# EAGLE design lcd240 (EAGLE 9.6.2)
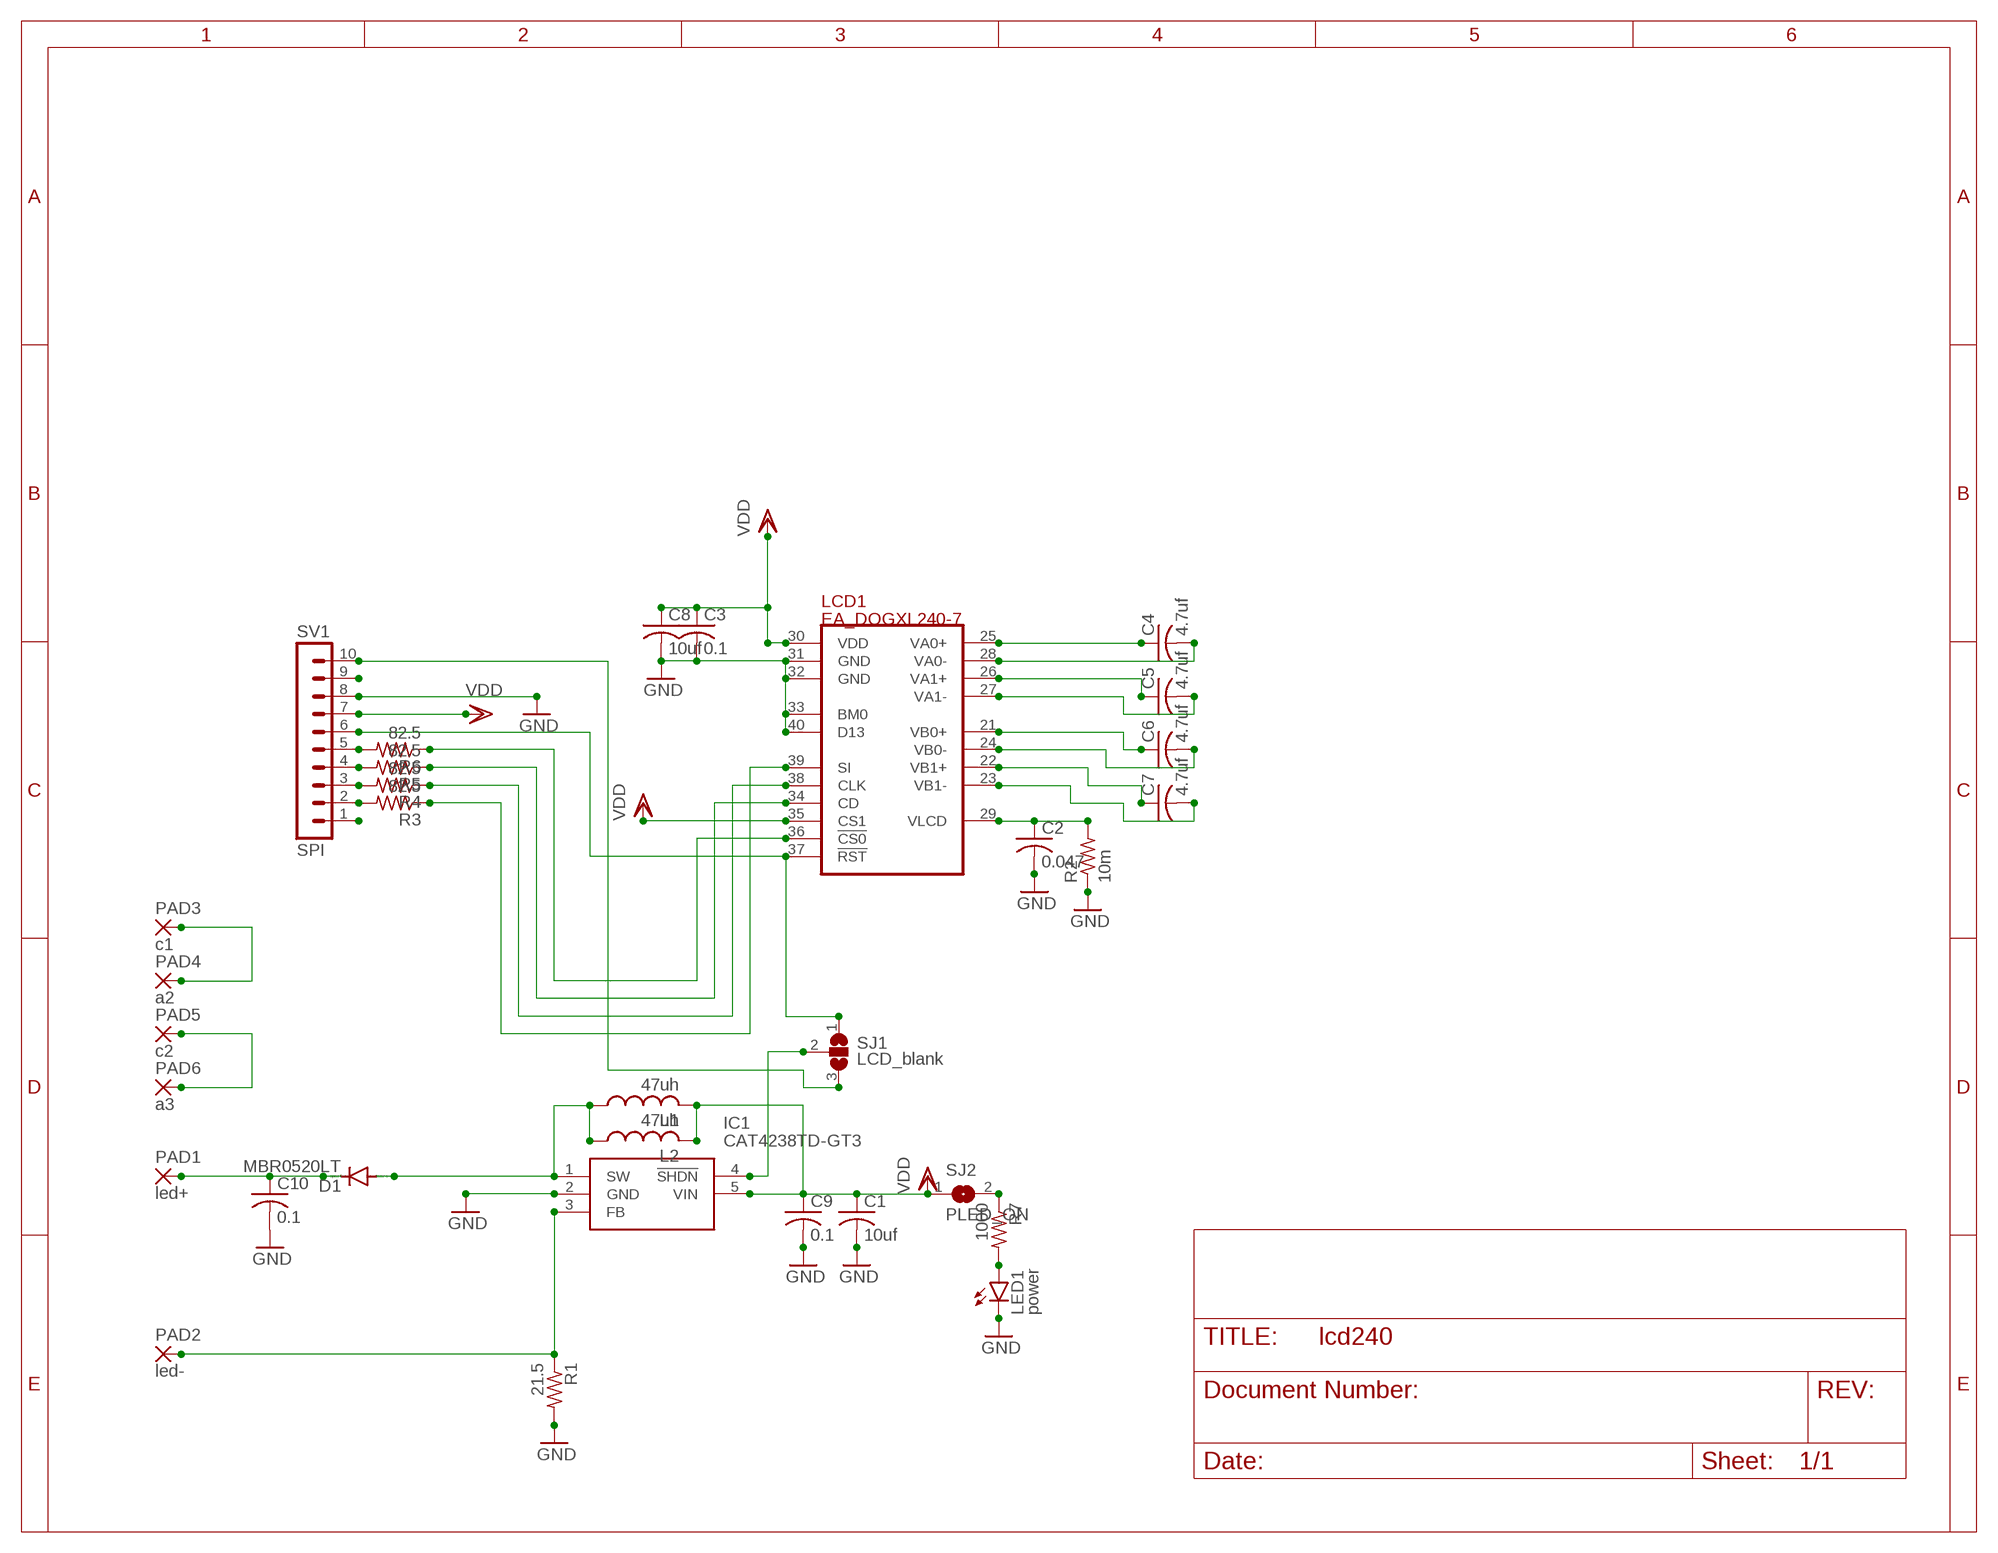
[diagram p0: schematic, sheet 1]

## Parts
C1  10uf  C-USC1206  [C1206]
C2  0.047  C-USC1206  [C1206]
C3  0.1  C-USC1206  [C1206]
C4  4.7uf  C-USC1206  [C1206]
C5  4.7uf  C-USC1206  [C1206]
C6  4.7uf  C-USC1206  [C1206]
C7  4.7uf  C-USC1206  [C1206]
C8  10uf  C-USC1206  [C1206]
C9  0.1  C-USC1206  [C1206]
C10  0.1  C-USC1206  [C1206]
D1  MBR0520LT  [SOD123]
IC1  CAT4238TD-GT3  [SOT95P280X100-5N]
L1  47uh  L-US0204/5  [0204/5]
L2  47uh  L-USL2012C  [L2012C]
LCD1  EA_DOGXL240-7  [EA_DOGXL240-7]
LED1  power  LEDSML0805  [SML0805]
PAD1  led+  1,6/0,8  [1,6/0,8]
PAD2  led-  1,6/0,8  [1,6/0,8]
PAD3  c1  1,6/0,8  [1,6/0,8]
PAD4  a2  1,6/0,8  [1,6/0,8]
PAD5  c2  1,6/0,8  [1,6/0,8]
PAD6  a3  1,6/0,8  [1,6/0,8]
R1  21.5  R-US_R0805  [R0805]
R2  10m  R-US_R0805  [R0805]
R3  82.5  R-US_R0805  [R0805]
R4  82.5  R-US_R0805  [R0805]
R5  82.5  R-US_R0805  [R0805]
R6  82.5  R-US_R0805  [R0805]
R7  1000  R-US_R0805  [R0805]
SJ1  LCD_blank  SJ2W  [SJ_2]
SJ2  PLED_ON  SJ  [SJ]
SV1  SPI  MA10-1  [MA10-1]

## Nets
GND [icurrent]: C1.2 C2.2 C3.2 C8.2 C9.2 C10.2 IC1.2(GND) LCD1.31(GND) LCD1.32(GND) LCD1.33(BM0) LCD1.40(D13) LED1.C R1.2 R2.1 SV1.8
N$1: C4.2 LCD1.28(VA0-)
N$2: C5.1 LCD1.26(VA1+)
N$3: C2.1 LCD1.29(VLCD) R2.2
N$4: LCD1.37(!RST!) SJ1.1 SV1.6
N$5: C5.2 LCD1.27(VA1-)
N$6: C4.1 LCD1.25(VA0+)
N$7: C6.1 LCD1.21(VB0+)
N$8: C6.2 LCD1.24(VB0-)
N$9: C7.1 LCD1.22(VB1+)
N$10: C7.2 LCD1.23(VB1-)
N$11: LCD1.36(!CS0!) R6.1
N$12: LCD1.34(CD) R5.1
N$13: LCD1.38(CLK) R4.1
N$14: LCD1.39(SI) R3.1
N$15 [led]: C10.1 D1.C PAD1.1(P)
N$16: SV1.9
N$17: SJ1.3 SV1.10
N$18: SV1.1
N$19: R3.2 SV1.2
N$20: R4.2 SV1.3
N$21: R6.2 SV1.5
N$22: R5.2 SV1.4
N$23: D1.A IC1.1(SW) L1.1 L2.1
N$24 [led]: IC1.3(FB) PAD2.1(P) R1.1
N$25 [led]: PAD3.1(P) PAD4.1(P)
N$26 [led]: PAD5.1(P) PAD6.1(P)
N$27: IC1.4(!SHDN) SJ1.2
N$28: R7.1 SJ2.2
N$29: LED1.A R7.2
VDD [icurrent]: C1.1 C3.1 C8.1 C9.1 IC1.5(VIN) L1.2 L2.2 LCD1.30(VDD) LCD1.35(CS1) SJ2.1 SV1.7

## Library data of the parts
C1-C10 = rcl:C-US: CAPACITOR, American symbol; SPICEPREFIX: C
D1 = diode:MBR0520LT: SCHOTTKY BARRIER RECTIFIER Source: http://onsemi.com .. MBR0520LT1-D.pdf
IC1 = CAT4238TD-GT3:CAT4238TD-GT3: Source: Datasheet <http://www.onsemi.com/pub/Collateral/CAT4238-D.PDF>; ARROW_PART_NUMBER: CAT4238TD-GT3; ARROW_PRICE-STOCK: https://www.arrow.com/en/products/cat4238td-gt3/on-semiconductor; HEIGHT: 1mm; MANUFACTURER_NAME: ON Semiconductor; MANUFACTURER_PART_NUMBER: CAT4238TD-GT3; MOUSER_PART_NUMBER: 698-CAT4238TDG; MOUSER_PRICE-STOCK: https://www.mouser.co.uk/ProductDetail/ON-Semiconductor/CAT4238TD-GT3?qs=9dFQwQorgSxpbLptXYtgxg%3D%3D
L1 L2 = rcl:L-US: INDUCTOR, American symbol; SPICEPREFIX: L
LCD1 = ea_v66:EA_DOGXL240-7
LED1 = led:LED: LED OSRAM: - CHIPLED LG R971, LG N971, LY N971, LG Q971, LY Q971, LO R971, LY R971 LH N974, LH R974 LS Q976, LO Q976, LY Q976 LO Q996 - Hyper CHIPLED LW Q18S LB Q993, LB Q99A, LB R99A - SideLED LS A670, LO A670, LY A670, LG A670, LP A670 LB A673, LV A673, LT A673, LW A673 LH A674 LY A675 LS A676, LA A676, LO A676, LY A676, LW A676 LS A679, LY A679, LG A679 - Hyper Micro SIDELED® LS Y876, LA Y876, LO Y876, LY Y876 LT Y87S - SmartLED LW L88C, LW L88S LB L89C, LB L89S, LG L890 LS L89K, LO L89K, LY L89K LS L896, LA L896, LO L896, LY L896 - TOPLED LS T670, LO T670, LY T670, LG T670, LP T670 LSG T670, LSP T670, LSY T670, LOP T670, LYG T670 LG T671, LOG T671, LSG T671 LB T673, LV T673, LT T673, LW T673 LH T674 LS T676, LA T676, LO T676, LY T676, LB T676, LH T676, LSB T676, LW T676 LB T67C, LV T67C, LT T67C, LS T67K, LO T67K, LY T67K, LW E67C LS E67B, LA E67B, LO E67B, LY E67B, LB E67C, LV E67C, LT E67C LW T67C LS T679, LY T679, LG T679 LS T770, LO T770, LY T770, LG T770, LP T770 LB T773, LV T773, LT T773, LW T773 LH T774 LS E675, LA E675, LY E675, LS T675 LS T776, LA T776, LO T776, LY T776, LB T776 LHGB T686 LT T68C, LB T68C - Hyper Mini TOPLED® LB M676 - Mini TOPLED Santana® LG M470 LS M47K, LO M47K, LY M47K Source: http://www.osram.convergy.de LUXEON: - LUMILED® LXK2-PW12-R00, LXK2-PW12-S00, LXK2-PW14-U00, LXK2-PW14-V00 LXK2-PM12-R00, LXK2-PM12-S00, LXK2-PM14-U00 LXK2-PE12-Q00, LXK2-PE12-R00, LXK2-PE12-S00, LXK2-PE14-T00, LXK2-PE14-U00 LXK2-PB12-K00, LXK2-PB12-L00, LXK2-PB12-M00, LXK2-PB14-N00, LXK2-PB14-P00, LXK2-PB14-Q00 LXK2-PR12-L00, LXK2-PR12-M00, LXK2-PR14-Q00, LXK2-PR14-R00 LXK2-PD12-Q00, LXK2-PD12-R00, LXK2-PD12-S00 LXK2-PH12-R00, LXK2-PH12-S00 LXK2-PL12-P00, LXK2-PL12-Q00, LXK2-PL12-R00 Source: www.luxeon.com KINGBRIGHT: KA-3528ASYC Source: www.kingbright.com
PAD1-PAD6 = wirepad:1,6/0,8: THROUGH-HOLE PAD
R1-R7 = rcl:R-US_: RESISTOR, American symbol; SPICEPREFIX: R
SJ1 = jumper:SJ2W: SMD solder JUMPER
SJ2 = jumper:SJ: SMD solder JUMPER
SV1 = con-lstb:MA10-1: PIN HEADER; OC_FARNELL: unknown; OC_NEWARK: unknown

## Net classes
1 icurrent: width 0.305 mm
2 led: width 0.305 mm, clearance 0.406 mm

## Board
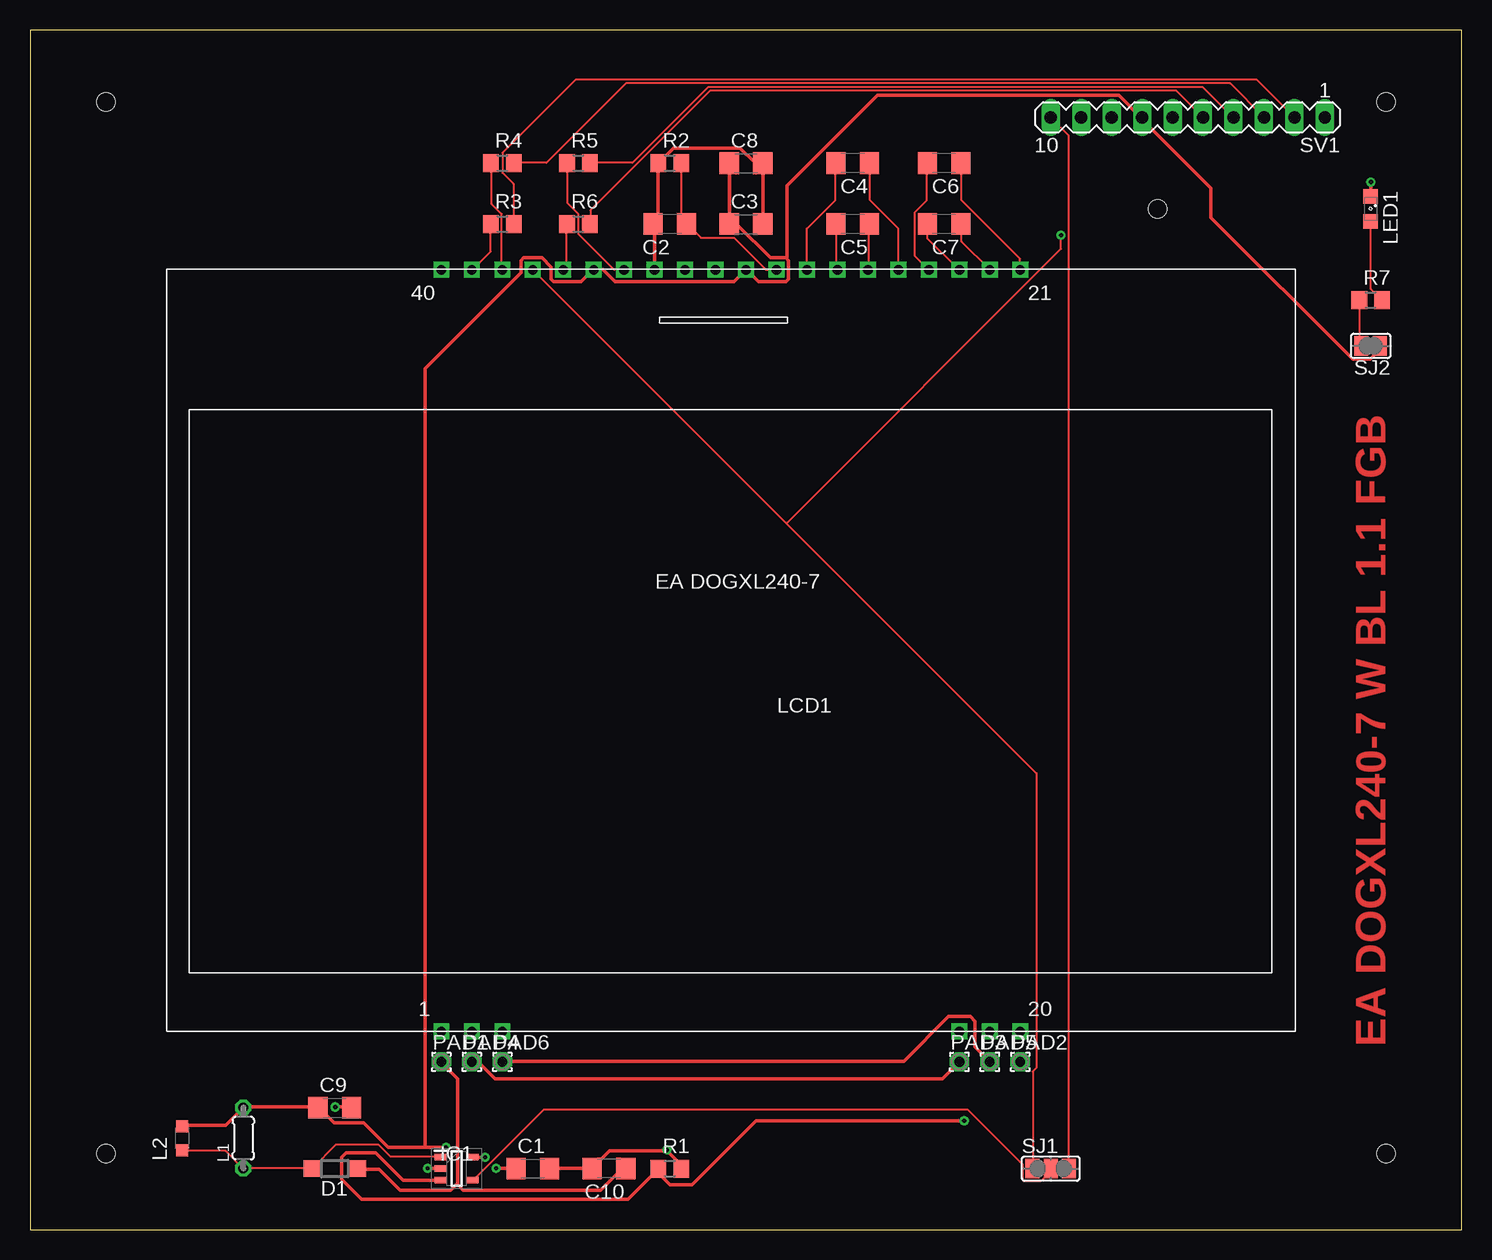
[diagram p1: board, top side]
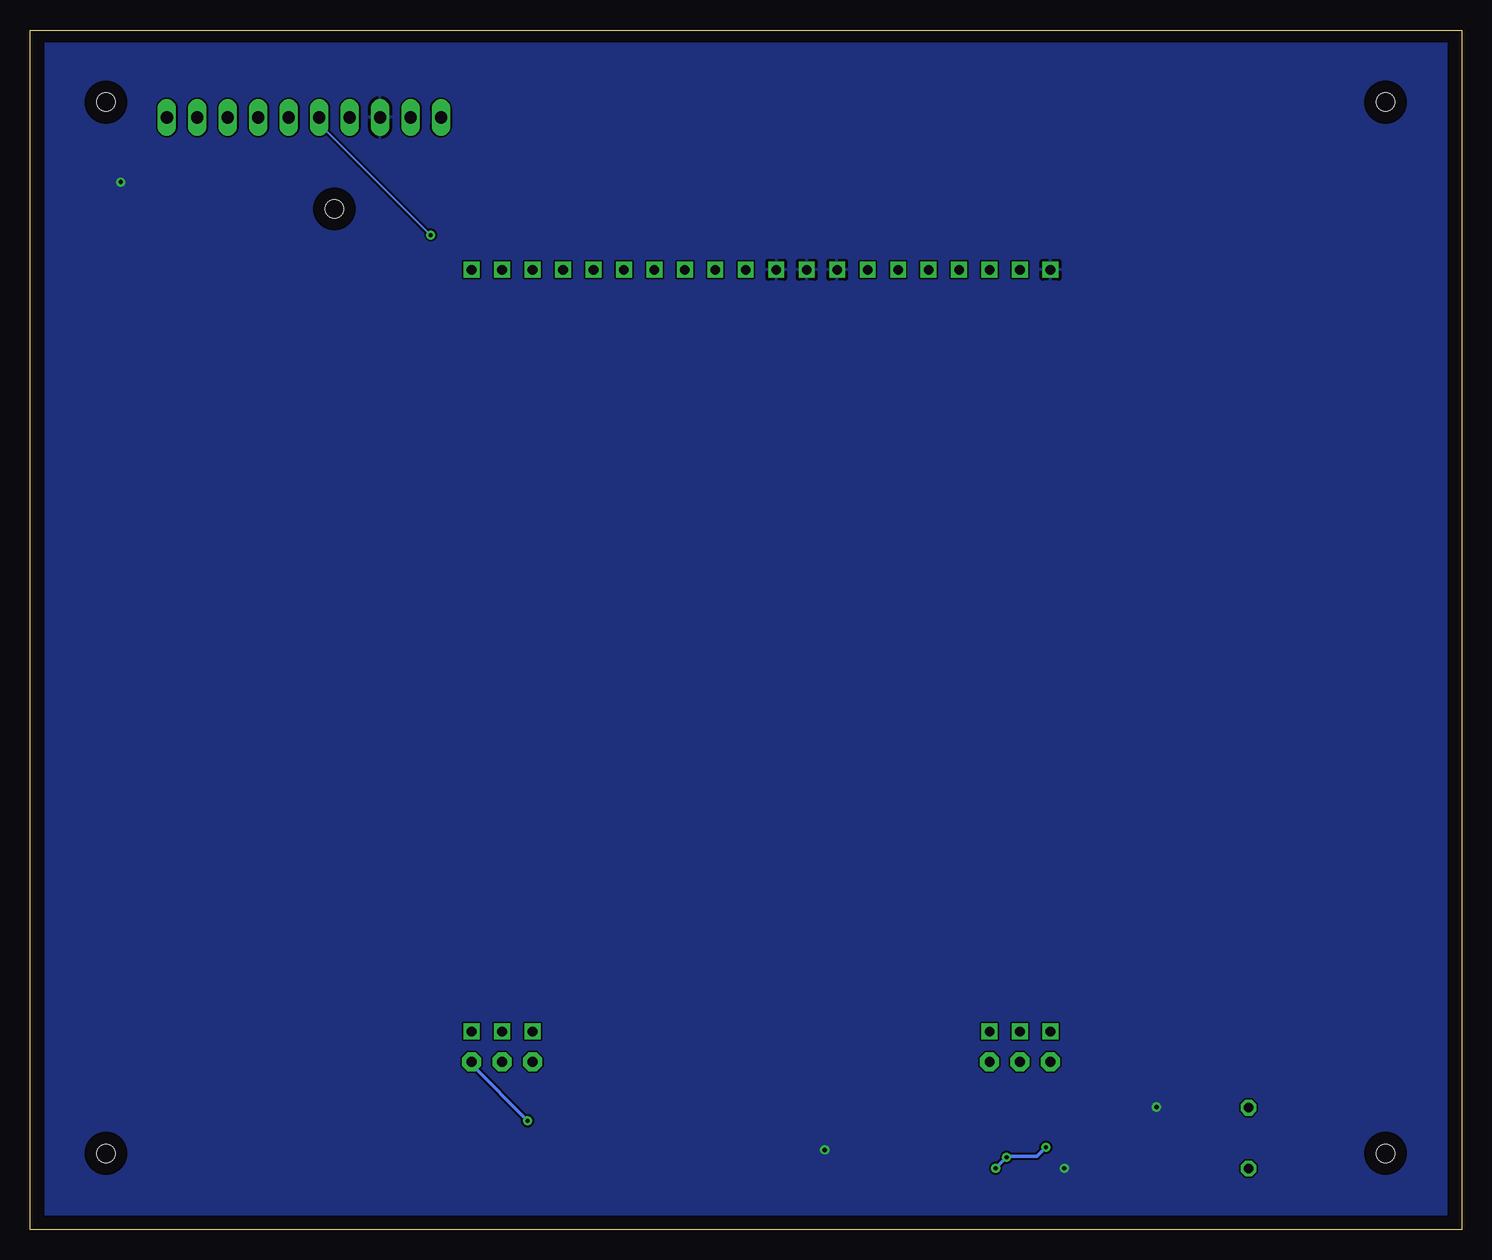
[diagram p2: board, bottom side, seen from below]

Size 119.36 x 100 mm. Coordinates in mm from the lower left corner, seen from the top.
Outline: 0,0 119.36,0 119.36,100 0,100 0,0
Copper layers (1*16): Top 0.035mm / dielectric 1.5mm / Bottom 0.035mm
Design rules "default": minimum track width 6mil, minimum drill 0.35mm, track to track 6mil, track to pad 6mil, pad to pad 6mil, via to via 6mil, smd to smd 6mil, copper to edge 40mil, drill to drill 6mil, minimum pad ring 10mil, minimum via ring 8mil, stop-mask expansion 4mil, vias tented up to drill 0mil, thermal gap 10mil
Holes 1.52 mm at 6.35,93.98 113.03,93.98 113.03,6.35 6.35,6.35 93.98,85.09

### Footprints (pad centres in the part's own frame; a part is rotated, then mirrored left to right if it is on the bottom)
C1206 = smd 1.6 x 1.8: 1 -1.4,0; 2 1.4,0
SOD123 = smd 1.4 x 1.4: A 1.9,0; C -1.9,0
SOT95P280X100-5N = smd 1.05 x 0.55: 1 -1.3,0.95; 2 -1.3,0; 3 -1.3,-0.95; 4 1.3,-0.95; 5 1.3,0.95
0204/5 = drill 0.813 octagon: 1 -2.54,0; 2 2.54,0
L2012C = smd 1 x 1: 1 -1,0; 2 1,0
EA_DOGXL240-7 = drill 0.813 square: 1 0,0; 2 2.54,0; 3 5.08,0; 18 43.18,0; 19 45.72,0; 20 48.26,0; 21 48.26,63.5; 22 45.72,63.5; 23 43.18,63.5; 24 40.64,63.5; 25 38.1,63.5; 26 35.56,63.5; 27 33.02,63.5; 28 30.48,63.5; 29 27.94,63.5; 30 25.4,63.5; 31 22.86,63.5; 32 20.32,63.5; 33 17.78,63.5; 34 15.24,63.5; 35 12.7,63.5; 36 10.16,63.5; 37 7.62,63.5; 38 5.08,63.5; 39 2.54,63.5; 40 0,63.5
SML0805 = smd 1.2 x 1.2: A 1.05,0; C -1.05,0
1,6/0,8 = drill 0.813 pad 1.6 octagon: 1 0,0
R0805 = smd 1.3 x 1.5: 1 -0.95,0; 2 0.95,0
SJ_2 = smd 1.168 x 1.6: 1 -1.524,0; 2 0,0; 3 1.524,0
SJ = smd 1.168 x 1.6: 1 -0.762,0; 2 0.762,0
MA10-1 = drill 1.016 long: 1 -11.43,0; 2 -8.89,0; 3 -6.35,0; 4 -3.81,0; 5 -1.27,0; 6 1.27,0; 7 3.81,0; 8 6.35,0; 9 8.89,0; 10 11.43,0

### Placement (x,y rotation side)
C1  41.91,5.08 0 top
C2  53.34,83.82 180 top
C3  59.69,83.82 0 top
C4  68.58,88.9 180 top
C5  68.58,83.82 180 top
C6  76.2,88.9 180 top
C7  76.2,83.82 180 top
C8  59.69,88.9 0 top
C9  25.4,10.16 0 top
C10  48.26,5.08 180 top
D1  25.4,5.08 180 top
IC1  35.56,5.08 0 top
L1  17.78,7.62 90 top
L2  12.7,7.62 90 top
LCD1  34.29,16.51 0 top
LED1  111.76,85.09 270 top
PAD1  34.29,13.97 0 top
PAD2  82.55,13.97 0 top
PAD3  77.47,13.97 0 top
PAD4  36.83,13.97 0 top
PAD5  80.01,13.97 0 top
PAD6  39.37,13.97 0 top
R1  53.34,5.08 0 top
R2  53.34,88.9 0 top
R3  39.37,83.82 0 top
R4  39.37,88.9 0 top
R5  45.72,88.9 0 top
R6  45.72,83.82 0 top
R7  111.76,77.47 0 top
SJ1  85.09,5.08 0 top
SJ2  111.76,73.66 180 top
SV1  96.52,92.71 180 top

### Tracks (layer width: path | path; a pad name or v marks a point on that pad's centre or on a via)
GND  (via drill 0.35)
  Top 0.305: 53.11,6.55 54.25,5.41 54.25,5.11 R1.2 | 53.11,6.55 48.31,6.55 46.86,5.11 C10.2 46.71,5.11 43.36,5.11 C1.2 | C3.2 61.11,83.82 61.11,88.85 C8.2 60.96,88.92 60.43,88.92 59.21,90.14 53.65,90.14 52.5,89 R2.1 52.35,88.85 52.35,84.2 51.97,83.82 C2.2 52.05,83.74 52.05,80.01 LCD1.33 | v33.15,5.11 34.21,5.11 IC1.2 | v111.78,87.33 111.78,86.18 LED1.C | v25.45,10.21 26.75,10.21 C9.2 | v53.11,6.63 53.11,6.55
  pour Bottom: 1.27,99.06 118.11,99.06 118.11,1.27 1.27,1.27
N$1
  Top 0.152: LCD1.28 64.77,83.44 67.13,85.8 67.13,88.85 C4.2
N$2
  Top 0.152: C5.1 69.95,83.82 69.95,80.09 69.88,80.01 LCD1.26
N$3
  Top 0.152: R2.2 54.33,88.85 54.33,84.2 54.71,83.82 C2.1 54.79,83.82 55.93,82.68 58.67,82.68 61.34,80.01 LCD1.29
N$4  (via drill 0.35)
  Top 0.152: LCD1.37 63.06,58.86 | 63.06,58.86 83.9,38.02 83.9,13.49 83.59,13.18 83.59,5.11 SJ1.1 | v85.95,82.91 85.95,81.76 63.06,58.86
  Bottom 0.152: SV1.6 95.25,92.2 v85.95,82.91
N$5
  Top 0.152: C5.2 67.21,83.82 67.21,80.09 67.28,80.01 LCD1.27
N$6
  Top 0.152: LCD1.25 72.39,83.44 70.03,85.8 70.03,88.85 C4.1
N$7
  Top 0.152: C6.1 77.65,88.85 77.65,85.8 82.53,80.92 82.53,80.01 LCD1.21
N$8
  Top 0.152: C6.2 74.75,88.85 74.75,85.8 73.76,84.81 73.76,81.15 74.91,80.01 LCD1.24
N$9
  Top 0.152: LCD1.22 77.65,82.37 77.65,83.82 C7.1
N$10
  Top 0.152: C7.2 74.83,83.82 74.83,82.6 77.42,80.01 LCD1.23
N$11
  Top 0.152: R6.1 44.73,83.82 44.73,80.24 44.5,80.01 LCD1.36
N$12
  Top 0.152: LCD1.34 48.69,80.01 45.72,82.98 45.72,84.66 44.81,85.57 44.81,88.85 R5.1
N$13
  Top 0.152: R4.1 38.48,88.85 38.48,85.5 39.32,84.66 39.32,80.01 LCD1.38
N$14
  Top 0.152: R3.1 38.41,83.82 38.41,81.53 36.88,80.01 LCD1.39
N$15
  Top 0.305: 35.59,3.81 35.66,3.89 35.66,12.57 34.29,13.95 PAD1.1 | 35.59,3.81 35.05,3.28 30.86,3.28 29.11,5.03 27.36,5.03 D1.C | 35.59,3.81 36.12,3.28 47.55,3.28 49.3,5.03 49.61,5.03 C10.1
N$17
  Top 0.152: SJ1.3 86.56,5.11 86.56,91.21 85.11,92.66 SV1.10
N$19
  Top 0.152: SV1.2 102.26,95.86 45.49,95.86 39.4,89.76 39.4,88.09 40.31,87.17 R3.2
N$20
  Top 0.152: R4.2 40.39,88.92 43.05,88.92 49.68,95.56 100.05,95.56 102.87,92.73 SV1.3
N$21
  Top 0.152: SV1.5 95.56,94.94 56.69,94.94 46.71,84.96 46.71,83.82 R6.2
N$22
  Top 0.152: R5.2 46.71,88.92 50.22,88.92 56.54,95.25 97.77,95.25 100.28,92.73 SV1.4
N$23
  Top 0.152: IC1.1 34.21,6.1 30.02,6.1 29.03,7.09 25.53,7.09 23.55,5.11 D1.A 23.47,5.11 17.83,5.11 L1.1 16.31,6.55 12.72,6.55 L2.1
N$24  (via drill 0.35)
  Top 0.305: IC1.3 34.21,4.12 31.09,4.12 28.8,6.4 26.36,6.4 25.98,6.02 25.98,4.19 27.66,2.52 49.84,2.52 52.35,5.03 R1.1 52.27,4.8 53.34,3.73 55.17,3.73 60.5,9.07 v77.88,9.07
  Bottom 0.305: v77.88,9.07 82.53,13.72 82.53,13.95 PAD2.1
N$25
  Top 0.305: PAD4.1 36.88,13.95 37.41,13.95 38.79,12.57 76.05,12.57 77.42,13.95 PAD3.1
N$26
  Top 0.305: PAD6.1 39.4,14.02 72.85,14.02 76.58,17.75 78.41,17.75 78.79,17.37 78.79,15.24 80.01,14.02 PAD5.1
N$27
  Top 0.152: IC1.4 36.88,4.19 37.03,4.19 42.82,9.98 78.18,9.98 82.75,5.41 82.75,4.12 82.83,4.04 84.28,4.04 85.04,4.8 85.04,5.03 SJ1.2
N$28
  Top 0.152: R7.1 110.87,77.42 110.87,73.76 110.95,73.69 SJ2.2
N$29
  Top 0.152: LED1.A 111.78,83.97 111.78,78.41 112.7,77.5 R7.2
VDD  (via drill 0.35)
  Top 0.305: v37.95,6.02 36.88,6.02 IC1.5 | v38.86,5.11 40.46,5.11 C1.1 | 32.92,6.86 29.87,6.86 27.81,8.91 25.38,8.91 24.16,10.13 C9.1 23.93,10.21 17.83,10.21 L1.2 16.31,8.69 12.72,8.69 L2.2 | 32.92,6.86 v34.67,6.86 | C8.1 58.29,88.85 C3.1 58.37,83.74 58.98,83.74 61.72,81 63.02,81 | 63.02,81 63.25,80.77 63.25,79.25 63.02,79.02 60.73,79.02 59.82,79.93 LCD1.30 59.66,80.01 58.67,79.02 48.77,79.02 47.78,80.01 LCD1.35 46.86,79.93 45.95,79.02 43.66,79.02 43.43,79.25 43.43,80.24 42.67,81 41.15,81 40.92,80.77 40.92,79.78 32.92,71.78 32.92,6.86 | SJ2.1 112.47,73.61 112.47,73.3 111.71,72.54 110.26,72.54 98.45,84.35 98.45,86.79 92.73,92.51 SV1.7 92.58,92.73 90.75,94.56 70.64,94.56 63.09,87.02 63.09,81.08 63.02,81
  Bottom 0.305: v38.86,5.11 v37.95,6.02 37.87,6.1 35.43,6.1 v34.67,6.86

### Text on the board
Top: EA DOGXL240-7 W BL 1.1 FGB